# Altium schematic sheet 接口.SchDoc
size A4
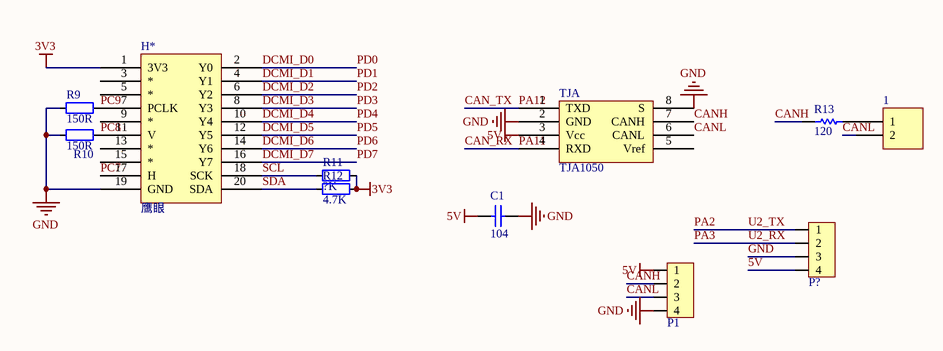
[diagram p0: 接口.SchDoc]

## Parts
1  Header 2  [SIP2]  (value not drawn)
C1  value 104  [CAP-MLCC-0603]  (hidden comment: CAP)
H*  鹰眼  [H10X2]
P1  HDR1x4_2.54  [HDR1x4_2.54_180]  (value not drawn)
P?  HDR1x4_2.54  [HDR1X4_2.54_90]  (value not drawn)
R9  value 150R  [RES_0603]  (hidden comment: Res_0603)
R10  value 150R  [RES_0603]  (hidden comment: Res_0603)
R11  value ?K  [RES_0603]  (hidden comment: Res_0603)
R12  value 4.7K  [RES_0603]  (hidden comment: Res_0603)
R13  value 120  [RES-0603]  (hidden comment: Res1)
TJA  TJA1050  [TJA1050]

## Nets
3V3: H*.1(3V3) R11.2 R12.2
5V: C1.2 P1.1 P?.4 TJA.3(Vcc)
GND: C1.1 H*.19(GND) P1.4 P?.3 R9.1 R10.1 TJA.2(GND) TJA.8(S)
CAN_RX: TJA.4(RXD)  [also labelled PA11]
CAN_TX: TJA.1(TXD)  [also labelled PA12]
CANH: P1.2 R13.2 TJA.7(CANH)
CANL: 1.2 P1.3 TJA.6(CANL)
DCMI_D0: H*.2(Y0)  [also labelled PD0]
DCMI_D1: H*.4(Y1)  [also labelled PD1]
DCMI_D2: H*.6(Y2)  [also labelled PD2]
DCMI_D3: H*.8(Y3)  [also labelled PD3]
DCMI_D4: H*.10(Y4)  [also labelled PD4]
DCMI_D5: H*.12(Y5)  [also labelled PD5]
DCMI_D6: H*.14(Y6)  [also labelled PD6]
DCMI_D7: H*.16(Y7)  [also labelled PD7]
PA2: P?.1  [also labelled U2_TX]
PA3: P?.2  [also labelled U2_RX]
PC7: H*.17(H)
PC8: H*.11(V) R10.2
PC9: H*.7(PCLK) R9.2
SCL: H*.18(SCK) R11.1
SDA: H*.20(SDA) R12.1
Net1_1: 1.1 R13.1

Not connected (* = marked no-connect by the designer): H* 3(*) 5(*) 9(*) 13(*) 15(*); TJA 5(Vref)

## Library data of the parts
1 = Header 2: Header, 2-Pin; LatestRevisionDate: 17-Jul-2002; LatestRevisionNote: Re-released for DXP Platform.; Publisher: Altium Limited
C1 = CAP: 无极性电容; Published: 8-Jun-2000; LatestRevisionDate: 17-Jul-2002; LatestRevisionNote: Re-released for DXP Platform.; PackageReference: RAD-0.3; Publisher: Altium Limited; PackageDescription: Radial Cap, Thru-Hole; 2 Leads; 0.3 in Pin Spacing
H* = 鹰眼: 鹰眼直插管脚
P1 P? = HDR1x4_2.54: Header
R9-R12 = Res_0603: Resistor
R13 = Res1: Resistor; Published: 8-Jun-2000; LatestRevisionDate: 17-Jul-2002; LatestRevisionNote: Re-released for DXP Platform.; PackageReference: AXIAL-0.3; Publisher: Altium Limited
TJA = TJA1050: CAN总线收发器